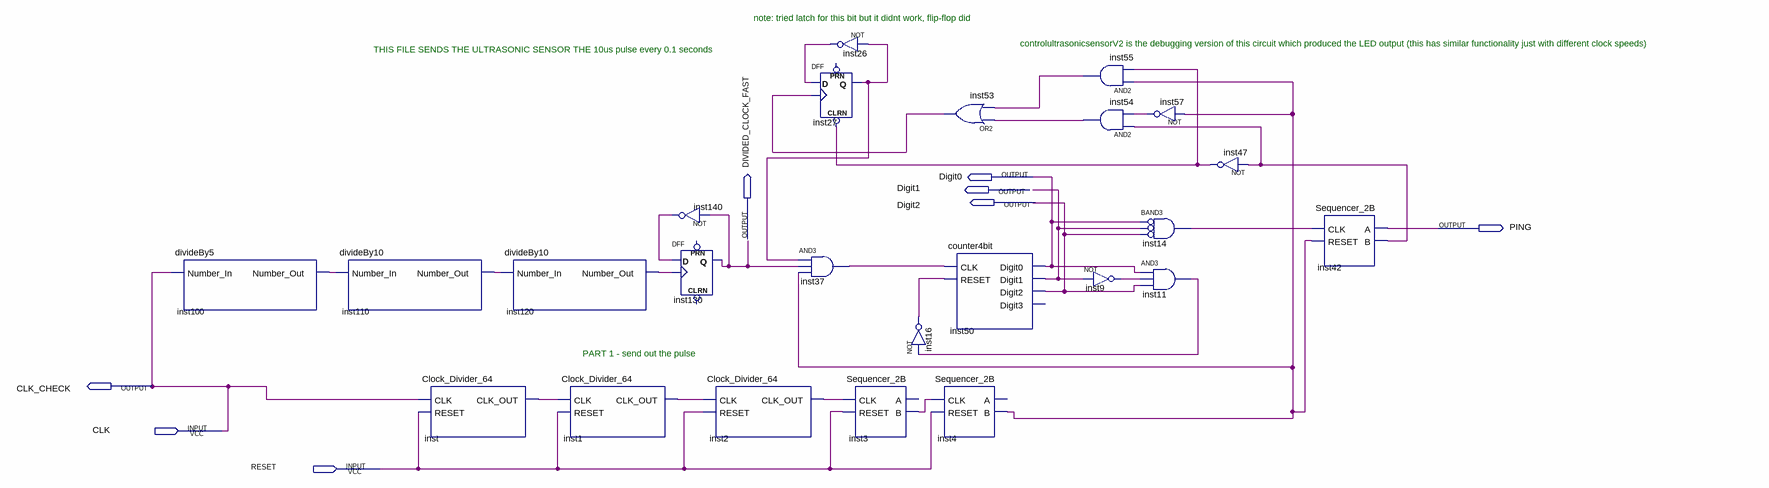
[diagram p0: schematic sheet]
// Quartus schematic controlultrasonicsensorfinal.bdf as structural Verilog: 24 symbols, 8 pins
module controlultrasonicsensorfinal (
  input  CLK,
  input  RESET,
  output Digit0,
  output Digit1,
  output Digit2,
  output PING,
  output DIVIDED_CLOCK_FAST,
  output CLK_CHECK
);

  wire inst1_clk_out, inst2_clk_out, inst3_b, inst4_b, inst9_out, inst11_out, inst14_out, inst16_out,
       inst26_out, inst27_q, inst37_out, inst42_b, inst47_out, inst53_out, inst54_out, inst55_out,
       inst57_out, inst100_number_out, inst110_number_out, inst120_number_out, inst140_out, inst_clk_out;

  divideBy5 inst100 (.Number_In(CLK), .Number_Out(inst100_number_out));
  divideBy10 inst110 (.Number_In(inst100_number_out), .Number_Out(inst110_number_out));
  Clock_Divider_64 inst (.CLK(CLK), .RESET(RESET), .CLK_OUT(inst_clk_out));
  divideBy10 inst120 (.Number_In(inst110_number_out), .Number_Out(inst120_number_out));
  Clock_Divider_64 inst1 (.CLK(inst_clk_out), .RESET(RESET), .CLK_OUT(inst1_clk_out));
  not inst140 (inst140_out, DIVIDED_CLOCK_FAST);
  DFF inst130 (.CLK(inst120_number_out), .D(inst140_out), .Q(DIVIDED_CLOCK_FAST));  // open: CLRN, PRN
  Clock_Divider_64 inst2 (.CLK(inst1_clk_out), .RESET(RESET), .CLK_OUT(inst2_clk_out));
  DFF inst27 (.CLRN(inst47_out), .CLK(inst53_out), .D(inst26_out), .Q(inst27_q));  // open: PRN
  and inst37 (inst37_out, inst27_q, DIVIDED_CLOCK_FAST, inst4_b);
  not inst26 (inst26_out, inst27_q);
  Sequencer_2B inst3 (.CLK(inst2_clk_out), .RESET(RESET), .B(inst3_b));  // open: A
  not inst16 (inst16_out, inst11_out);
  or inst53 (inst53_out, inst54_out, inst55_out);
  counter4bit inst50 (
    .CLK(inst37_out), .RESET(inst16_out), .Digit0(Digit0), .Digit1(Digit1), .Digit2(Digit2));  // open: Digit3
  Sequencer_2B inst4 (.CLK(inst3_b), .RESET(RESET), .B(inst4_b));  // open: A
  and inst55 (inst55_out, inst4_b, inst47_out);
  and inst54 (inst54_out, inst42_b, inst57_out);
  not inst9 (inst9_out, Digit1);
  not inst57 (inst57_out, inst4_b);
  and inst14 (inst14_out, ~Digit0, ~Digit1, ~Digit2);  // BAND3
  and inst11 (inst11_out, Digit0, inst9_out, Digit2);
  not inst47 (inst47_out, inst42_b);
  Sequencer_2B inst42 (.CLK(inst14_out), .RESET(inst4_b), .A(PING), .B(inst42_b));

  assign CLK_CHECK = CLK;

  // Notes on the sheet:
  //   note: tried latch for this bit but it didnt work, flip-flop did
  //   controlultrasonicsensorV2 is the debugging version of this circuit which produced the LED output (this has similar functionality just with different clock speeds)
  //   THIS FILE SENDS THE ULTRASONIC SENSOR THE 10us pulse every 0.1 seconds
  //   PART 1 - send out the pulse
endmodule
